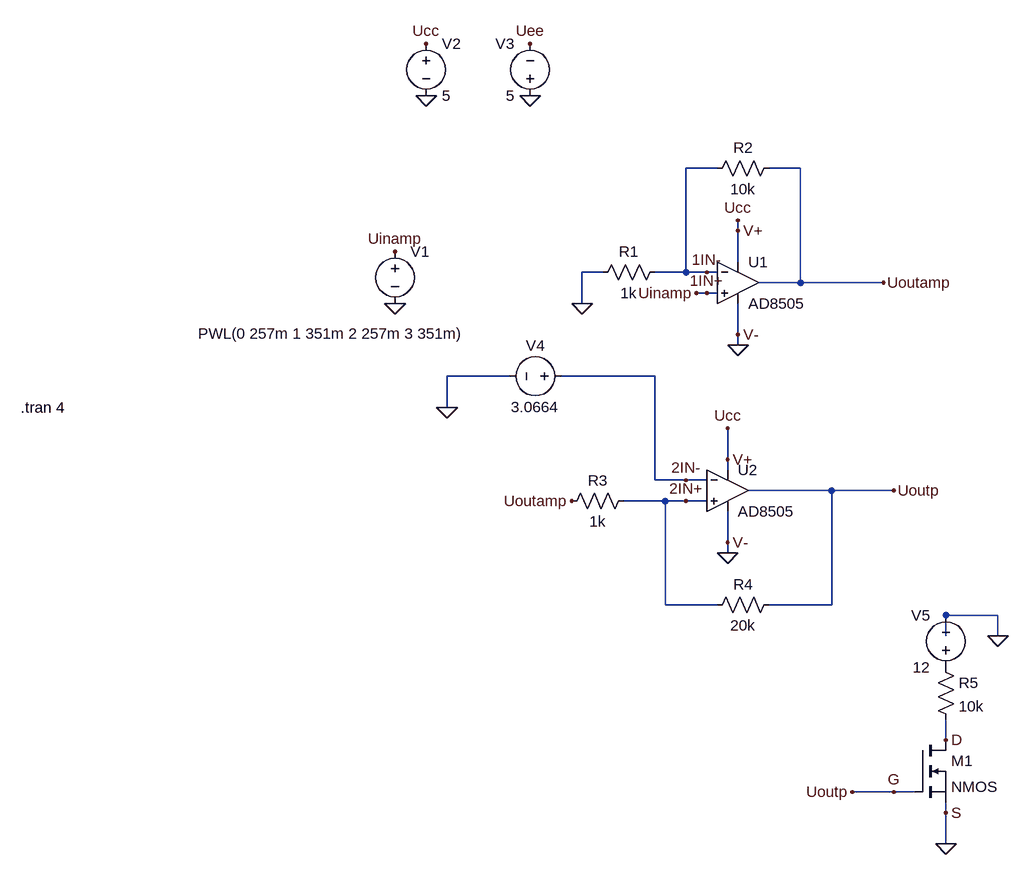
[diagram p0: schematic l5.asc]
l5.asc, the LTspice schematic file:
Version 4
SHEET 1 2324 1084
WIRE 512 16 464 16
WIRE 640 16 592 16
WIRE 544 112 544 96
WIRE 544 160 544 112
WIRE 336 176 304 176
WIRE 464 176 464 16
WIRE 464 176 416 176
WIRE 496 176 464 176
WIRE 512 176 496 176
WIRE 640 192 640 16
WIRE 640 192 576 192
WIRE 768 192 640 192
WIRE 496 208 480 208
WIRE 512 208 496 208
WIRE 304 224 304 176
WIRE 544 272 544 224
WIRE 544 288 544 272
WIRE 192 336 96 336
WIRE 416 336 272 336
WIRE 96 384 96 336
WIRE 528 464 528 416
WIRE 528 480 528 464
WIRE 416 496 416 336
WIRE 464 496 416 496
WIRE 496 496 464 496
WIRE 688 512 560 512
WIRE 784 512 688 512
WIRE 432 528 368 528
WIRE 464 528 432 528
WIRE 496 528 464 528
WIRE 528 592 528 544
WIRE 528 608 528 592
WIRE 432 688 432 528
WIRE 512 688 432 688
WIRE 688 688 688 512
WIRE 688 688 592 688
WIRE 944 704 864 704
WIRE 864 736 864 704
WIRE 944 736 944 704
WIRE 864 896 864 864
WIRE 784 976 720 976
WIRE 816 976 784 976
WIRE 864 1008 864 992
WIRE 864 1056 864 1008
FLAG 16 144 Uinamp
FLAG 16 224 0
FLAG 304 224 0
FLAG 64 -96 0
FLAG 224 -96 0
FLAG 64 -176 Ucc
FLAG 224 -176 Uee
FLAG 544 96 Ucc
FLAG 768 192 Uoutamp
FLAG 480 208 Uinamp
FLAG 288 528 Uoutamp
FLAG 96 384 0
FLAG 528 416 Ucc
FLAG 784 512 Uoutp
FLAG 864 1056 0
FLAG 944 736 0
FLAG 864 896 D
FLAG 864 1008 S
FLAG 784 976 G
FLAG 720 976 Uoutp
FLAG 496 208 1IN+
FLAG 496 176 1IN-
FLAG 544 112 V+
FLAG 544 272 V-
FLAG 544 288 0
FLAG 528 608 0
FLAG 464 496 2IN-
FLAG 464 528 2IN+
FLAG 528 464 V+
FLAG 528 592 V-
SYMBOL res 432 160 R90
WINDOW 0 0 56 VBottom 2
WINDOW 3 32 56 VTop 2
SYMATTR InstName R1
SYMATTR Value 1k
SYMBOL res 608 0 R90
WINDOW 0 0 56 VBottom 2
WINDOW 3 32 56 VTop 2
SYMATTR InstName R2
SYMATTR Value 10k
SYMBOL voltage 64 -192 R0
SYMATTR InstName V2
SYMATTR Value 5
SYMBOL voltage 224 -80 R180
WINDOW 0 24 96 Left 2
WINDOW 3 24 16 Left 2
SYMATTR InstName V3
SYMATTR Value 5
SYMBOL res 384 512 R90
WINDOW 0 0 56 VBottom 2
WINDOW 3 32 56 VTop 2
SYMATTR InstName R3
SYMATTR Value 1k
SYMBOL res 608 672 R90
WINDOW 0 0 56 VBottom 2
WINDOW 3 32 56 VTop 2
SYMATTR InstName R4
SYMATTR Value 20k
SYMBOL OpAmps\\AD8505 528 448 R0
SYMATTR InstName U2
SYMBOL voltage 288 336 R90
WINDOW 0 -32 56 VBottom 2
WINDOW 3 32 56 VTop 2
SYMATTR InstName V4
SYMATTR Value 3.0664
SYMBOL OpAmps\\AD8505 544 128 R0
SYMATTR InstName U1
SYMBOL nmos 816 896 R0
SYMATTR InstName M1
SYMBOL res 848 768 R0
SYMATTR InstName R5
SYMATTR Value 10k
SYMBOL voltage 864 800 R180
WINDOW 0 24 96 Left 2
WINDOW 3 24 16 Left 2
SYMATTR InstName V5
SYMATTR Value 12
SYMBOL voltage 16 128 R0
WINDOW 3 -303 142 Left 2
WINDOW 123 0 0 Left 0
WINDOW 39 0 0 Left 0
SYMATTR InstName V1
SYMATTR Value PWL(0 257m 1 351m 2 257m 3 351m)
TEXT -560 384 Left 2 !.tran 4

The netlist it stands for:
* l5.asc
R1 1IN- 0 1k
R2 Uoutamp 1IN- 10k
V2 V+ 0 5
V3 0 Uee 5
R3 2IN+ Uoutamp 1k
R4 G 2IN+ 20k
XU2 2IN+ 2IN- V+ 0 G AD8505  ; pins In+ In- V+ V- OUT
V4 2IN- 0 3.0664
XU1 1IN+ 1IN- V+ 0 Uoutamp AD8505  ; pins In+ In- V+ V- OUT
M1 D G 0 0 NMOS
R5 P001 D 10k
V5 P001 0 12
V1 1IN+ 0 PWL(0 257m 1 351m 2 257m 3 351m)
.model NMOS NMOS
.model PMOS PMOS
.lib standard.mos
.tran 4
.backanno
.end